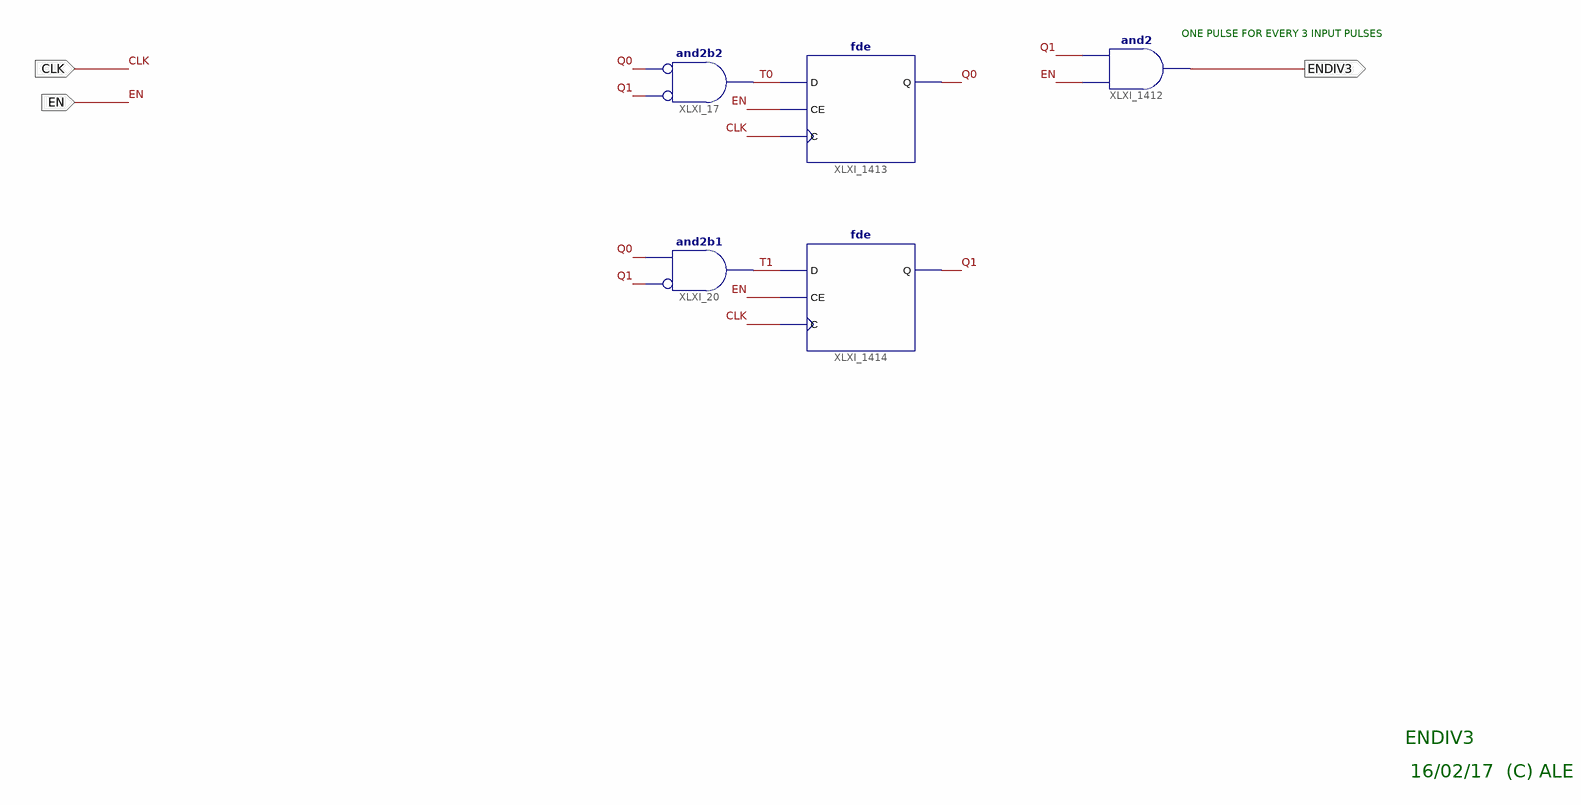
[diagram p0: schematic sheet 1]
// Xilinx ISE schematic EnDiv3.sch (zynq) as structural Verilog: 5 symbols, 3 ports
module EnDiv3 (
  input  CLK,
  input  EN,
  output ENDIV3
);

  wire Q0, Q1, T0, T1;

  and XLXI_17 (T0, ~Q1, ~Q0);  // and2b2
  and XLXI_20 (T1, ~Q1, Q0);  // and2b1
  fde XLXI_1413 (.C(CLK), .CE(EN), .D(T0), .Q(Q0));
  fde XLXI_1414 (.C(CLK), .CE(EN), .D(T1), .Q(Q1));
  and XLXI_1412 (ENDIV3, EN, Q1);

  // Notes on the sheet:
  //   ONE PULSE FOR EVERY 3 INPUT PULSES
  //   ENDIV3
  //   16/02/17  (C) ALE
endmodule
